# Altium project Capacitor VIAs.PrjPcb
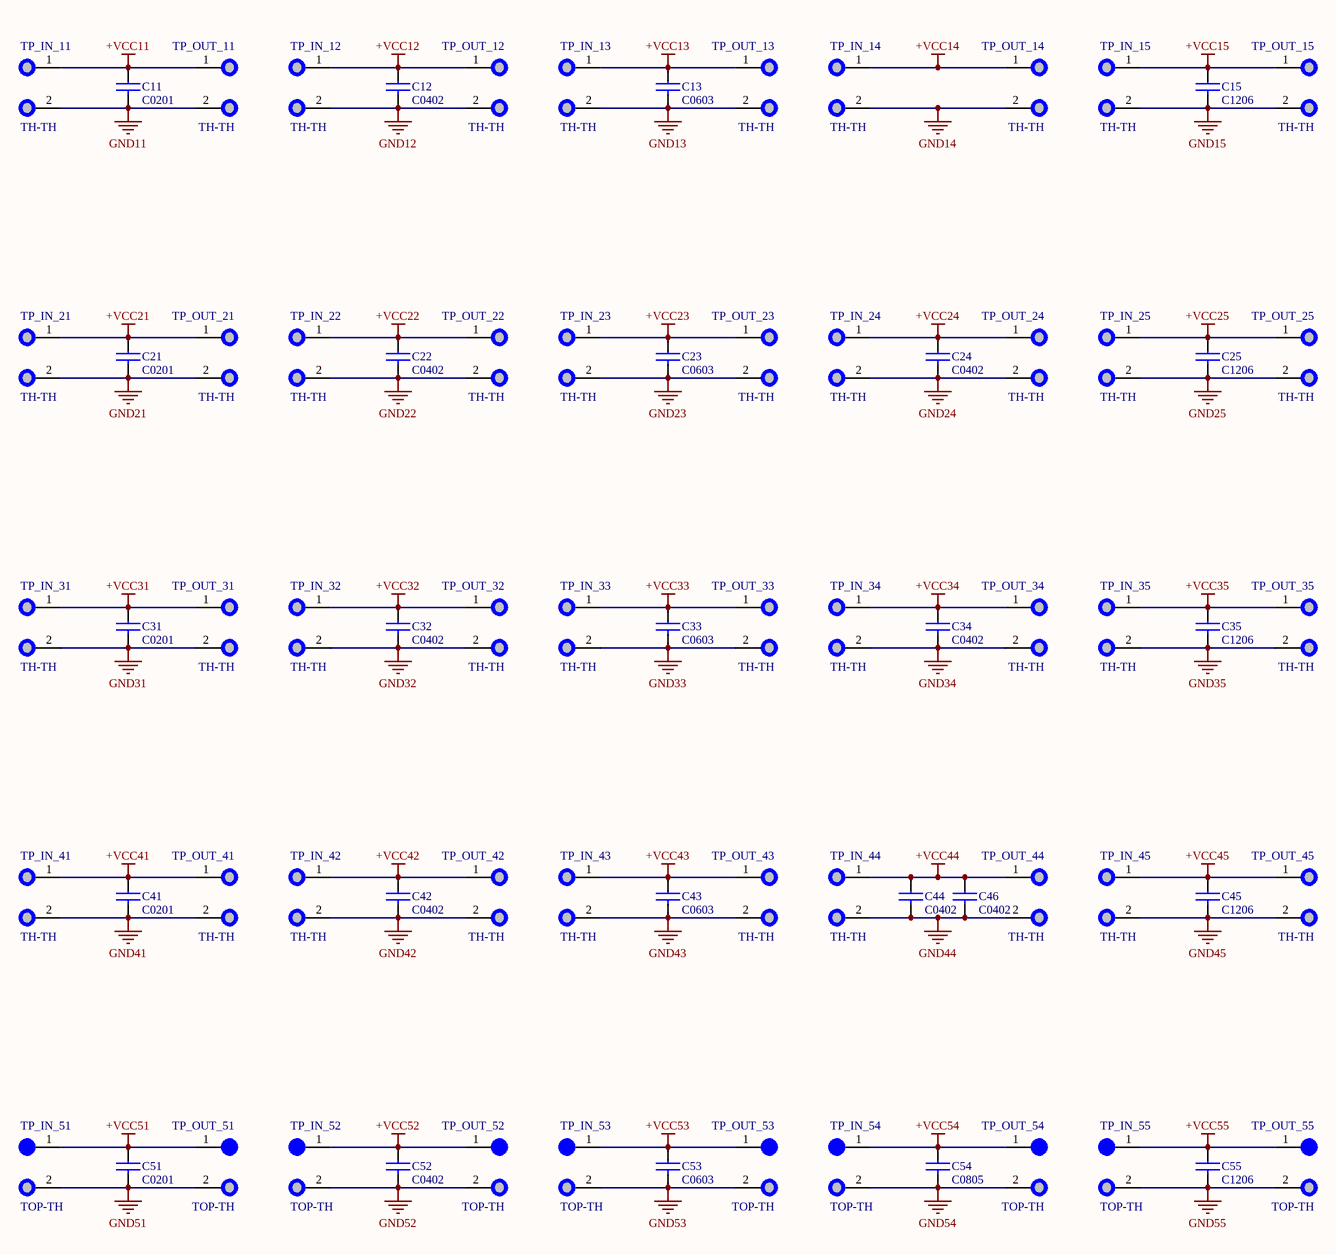
[diagram p0: Schematic.SchDoc]
1 sheet, 75 parts. Net scope: global (net labels, ports and power ports of the same name join across sheets).
Board file: PCB01.PcbDoc

## Sheet Schematic.SchDoc
size A3

### Parts
C11  C0201  [C0201]
C12  C0402  [C0402]
C13  C0603  [C0603]
C15  C1206  [C1206]
C21  C0201  [C0201]
C22  C0402  [C0402]
C23  C0603  [C0603]
C24  C0402  [C0402]
C25  C1206  [C1206]
C31  C0201  [C0201]
C32  C0402  [C0402]
C33  C0603  [C0603]
C34  C0402  [C0402]
C35  C1206  [C1206]
C41  C0201  [C0201]
C42  C0402  [C0402]
C43  C0603  [C0603]
C44  C0402  [C0402]
C45  C1206  [C1206]
C46  C0402  [C0402]
C51  C0201  [C0201]
C52  C0402  [C0402]
C53  C0603  [C0603]
C54  C0805  [C0805]
C55  C1206  [C1206]
TP_IN_11  TH-TH  [TP_TH_TH]
TP_IN_12  TH-TH  [TP_TH_TH]
TP_IN_13  TH-TH  [TP_TH_TH]
TP_IN_14  TH-TH  [TP_TH_TH]
TP_IN_15  TH-TH  [TP_TH_TH]
TP_IN_21  TH-TH  [TP_TH_TH]
TP_IN_22  TH-TH  [TP_TH_TH]
TP_IN_23  TH-TH  [TP_TH_TH]
TP_IN_24  TH-TH  [TP_TH_TH]
TP_IN_25  TH-TH  [TP_TH_TH]
TP_IN_31  TH-TH  [TP_TH_TH]
TP_IN_32  TH-TH  [TP_TH_TH]
TP_IN_33  TH-TH  [TP_TH_TH]
TP_IN_34  TH-TH  [TP_TH_TH]
TP_IN_35  TH-TH  [TP_TH_TH]
TP_IN_41  TH-TH  [TP_TH_TH]
TP_IN_42  TH-TH  [TP_TH_TH]
TP_IN_43  TH-TH  [TP_TH_TH]
TP_IN_44  TH-TH  [TP_TH_TH]
TP_IN_45  TH-TH  [TP_TH_TH]
TP_IN_51  TOP-TH  [TP_TOP_TH]
TP_IN_52  TOP-TH  [TP_TOP_TH]
TP_IN_53  TOP-TH  [TP_TOP_TH]
TP_IN_54  TOP-TH  [TP_TOP_TH]
TP_IN_55  TOP-TH  [TP_TOP_TH]
TP_OUT_11  TH-TH  [TP_TH_TH]
TP_OUT_12  TH-TH  [TP_TH_TH]
TP_OUT_13  TH-TH  [TP_TH_TH]
TP_OUT_14  TH-TH  [TP_TH_TH]
TP_OUT_15  TH-TH  [TP_TH_TH]
TP_OUT_21  TH-TH  [TP_TH_TH]
TP_OUT_22  TH-TH  [TP_TH_TH]
TP_OUT_23  TH-TH  [TP_TH_TH]
TP_OUT_24  TH-TH  [TP_TH_TH]
TP_OUT_25  TH-TH  [TP_TH_TH]
TP_OUT_31  TH-TH  [TP_TH_TH]
TP_OUT_32  TH-TH  [TP_TH_TH]
TP_OUT_33  TH-TH  [TP_TH_TH]
TP_OUT_34  TH-TH  [TP_TH_TH]
TP_OUT_35  TH-TH  [TP_TH_TH]
TP_OUT_41  TH-TH  [TP_TH_TH]
TP_OUT_42  TH-TH  [TP_TH_TH]
TP_OUT_43  TH-TH  [TP_TH_TH]
TP_OUT_44  TH-TH  [TP_TH_TH]
TP_OUT_45  TH-TH  [TP_TH_TH]
TP_OUT_51  TOP-TH  [TP_TOP_TH]
TP_OUT_52  TOP-TH  [TP_TOP_TH]
TP_OUT_53  TOP-TH  [TP_TOP_TH]
TP_OUT_54  TOP-TH  [TP_TOP_TH]
TP_OUT_55  TOP-TH  [TP_TOP_TH]

### Nets
+VCC11: C11.1 TP_IN_11.1 TP_OUT_11.1
+VCC12: C12.1 TP_IN_12.1 TP_OUT_12.1
+VCC13: C13.1 TP_IN_13.1 TP_OUT_13.1
+VCC14: TP_IN_14.1 TP_OUT_14.1
+VCC15: C15.1 TP_IN_15.1 TP_OUT_15.1
+VCC21: C21.1 TP_IN_21.1 TP_OUT_21.1
+VCC22: C22.1 TP_IN_22.1 TP_OUT_22.1
+VCC23: C23.1 TP_IN_23.1 TP_OUT_23.1
+VCC24: C24.1 TP_IN_24.1 TP_OUT_24.1
+VCC25: C25.1 TP_IN_25.1 TP_OUT_25.1
+VCC31: C31.1 TP_IN_31.1 TP_OUT_31.1
+VCC32: C32.1 TP_IN_32.1 TP_OUT_32.1
+VCC33: C33.1 TP_IN_33.1 TP_OUT_33.1
+VCC34: C34.1 TP_IN_34.1 TP_OUT_34.1
+VCC35: C35.1 TP_IN_35.1 TP_OUT_35.1
+VCC41: C41.1 TP_IN_41.1 TP_OUT_41.1
+VCC42: C42.1 TP_IN_42.1 TP_OUT_42.1
+VCC43: C43.1 TP_IN_43.1 TP_OUT_43.1
+VCC44: C44.1 C46.1 TP_IN_44.1 TP_OUT_44.1
+VCC45: C45.1 TP_IN_45.1 TP_OUT_45.1
+VCC51: C51.1 TP_IN_51.1 TP_OUT_51.1
+VCC52: C52.1 TP_IN_52.1 TP_OUT_52.1
+VCC53: C53.1 TP_IN_53.1 TP_OUT_53.1
+VCC54: C54.1 TP_IN_54.1 TP_OUT_54.1
+VCC55: C55.1 TP_IN_55.1 TP_OUT_55.1
GND11: C11.2 TP_IN_11.2 TP_OUT_11.2
GND12: C12.2 TP_IN_12.2 TP_OUT_12.2
GND13: C13.2 TP_IN_13.2 TP_OUT_13.2
GND14: TP_IN_14.2 TP_OUT_14.2
GND15: C15.2 TP_IN_15.2 TP_OUT_15.2
GND21: C21.2 TP_IN_21.2 TP_OUT_21.2
GND22: C22.2 TP_IN_22.2 TP_OUT_22.2
GND23: C23.2 TP_IN_23.2 TP_OUT_23.2
GND24: C24.2 TP_IN_24.2 TP_OUT_24.2
GND25: C25.2 TP_IN_25.2 TP_OUT_25.2
GND31: C31.2 TP_IN_31.2 TP_OUT_31.2
GND32: C32.2 TP_IN_32.2 TP_OUT_32.2
GND33: C33.2 TP_IN_33.2 TP_OUT_33.2
GND34: C34.2 TP_IN_34.2 TP_OUT_34.2
GND35: C35.2 TP_IN_35.2 TP_OUT_35.2
GND41: C41.2 TP_IN_41.2 TP_OUT_41.2
GND42: C42.2 TP_IN_42.2 TP_OUT_42.2
GND43: C43.2 TP_IN_43.2 TP_OUT_43.2
GND44: C44.2 C46.2 TP_IN_44.2 TP_OUT_44.2
GND45: C45.2 TP_IN_45.2 TP_OUT_45.2
GND51: C51.2 TP_IN_51.2 TP_OUT_51.2
GND52: C52.2 TP_IN_52.2 TP_OUT_52.2
GND53: C53.2 TP_IN_53.2 TP_OUT_53.2
GND54: C54.2 TP_IN_54.2 TP_OUT_54.2
GND55: C55.2 TP_IN_55.2 TP_OUT_55.2

### Library data of the parts
C11 C21 C31 C41 C51 = CAP0201
C12 C22 C24 C32 C34 C42 C44 C46 C52 = CAP0402
C13 C23 C33 C43 C53 = CAP0603
C15 C25 C35 C45 C55 = CAP1206
C54 = CAP0805
TP_IN_11-TP_IN_15 TP_IN_21-TP_IN_25 TP_IN_31-TP_IN_35 TP_IN_41-TP_IN_45 TP_OUT_11-TP_OUT_15 TP_OUT_21-TP_OUT_25 TP_OUT_31-TP_OUT_35 TP_OUT_41-TP_OUT_45 = TP_TH_TH: Testpoints TH - TH 1mm/0.3mm
TP_IN_51-TP_IN_55 TP_OUT_51-TP_OUT_55 = TP_TOP_TH: Testpoints TOP - TH 1mm/0.3mm